# EAGLE design Franzino (EAGLE 8.3.1)
CNAME: Franzino; CREVISION: V0RV1; DESIGNER: Fábio Souza
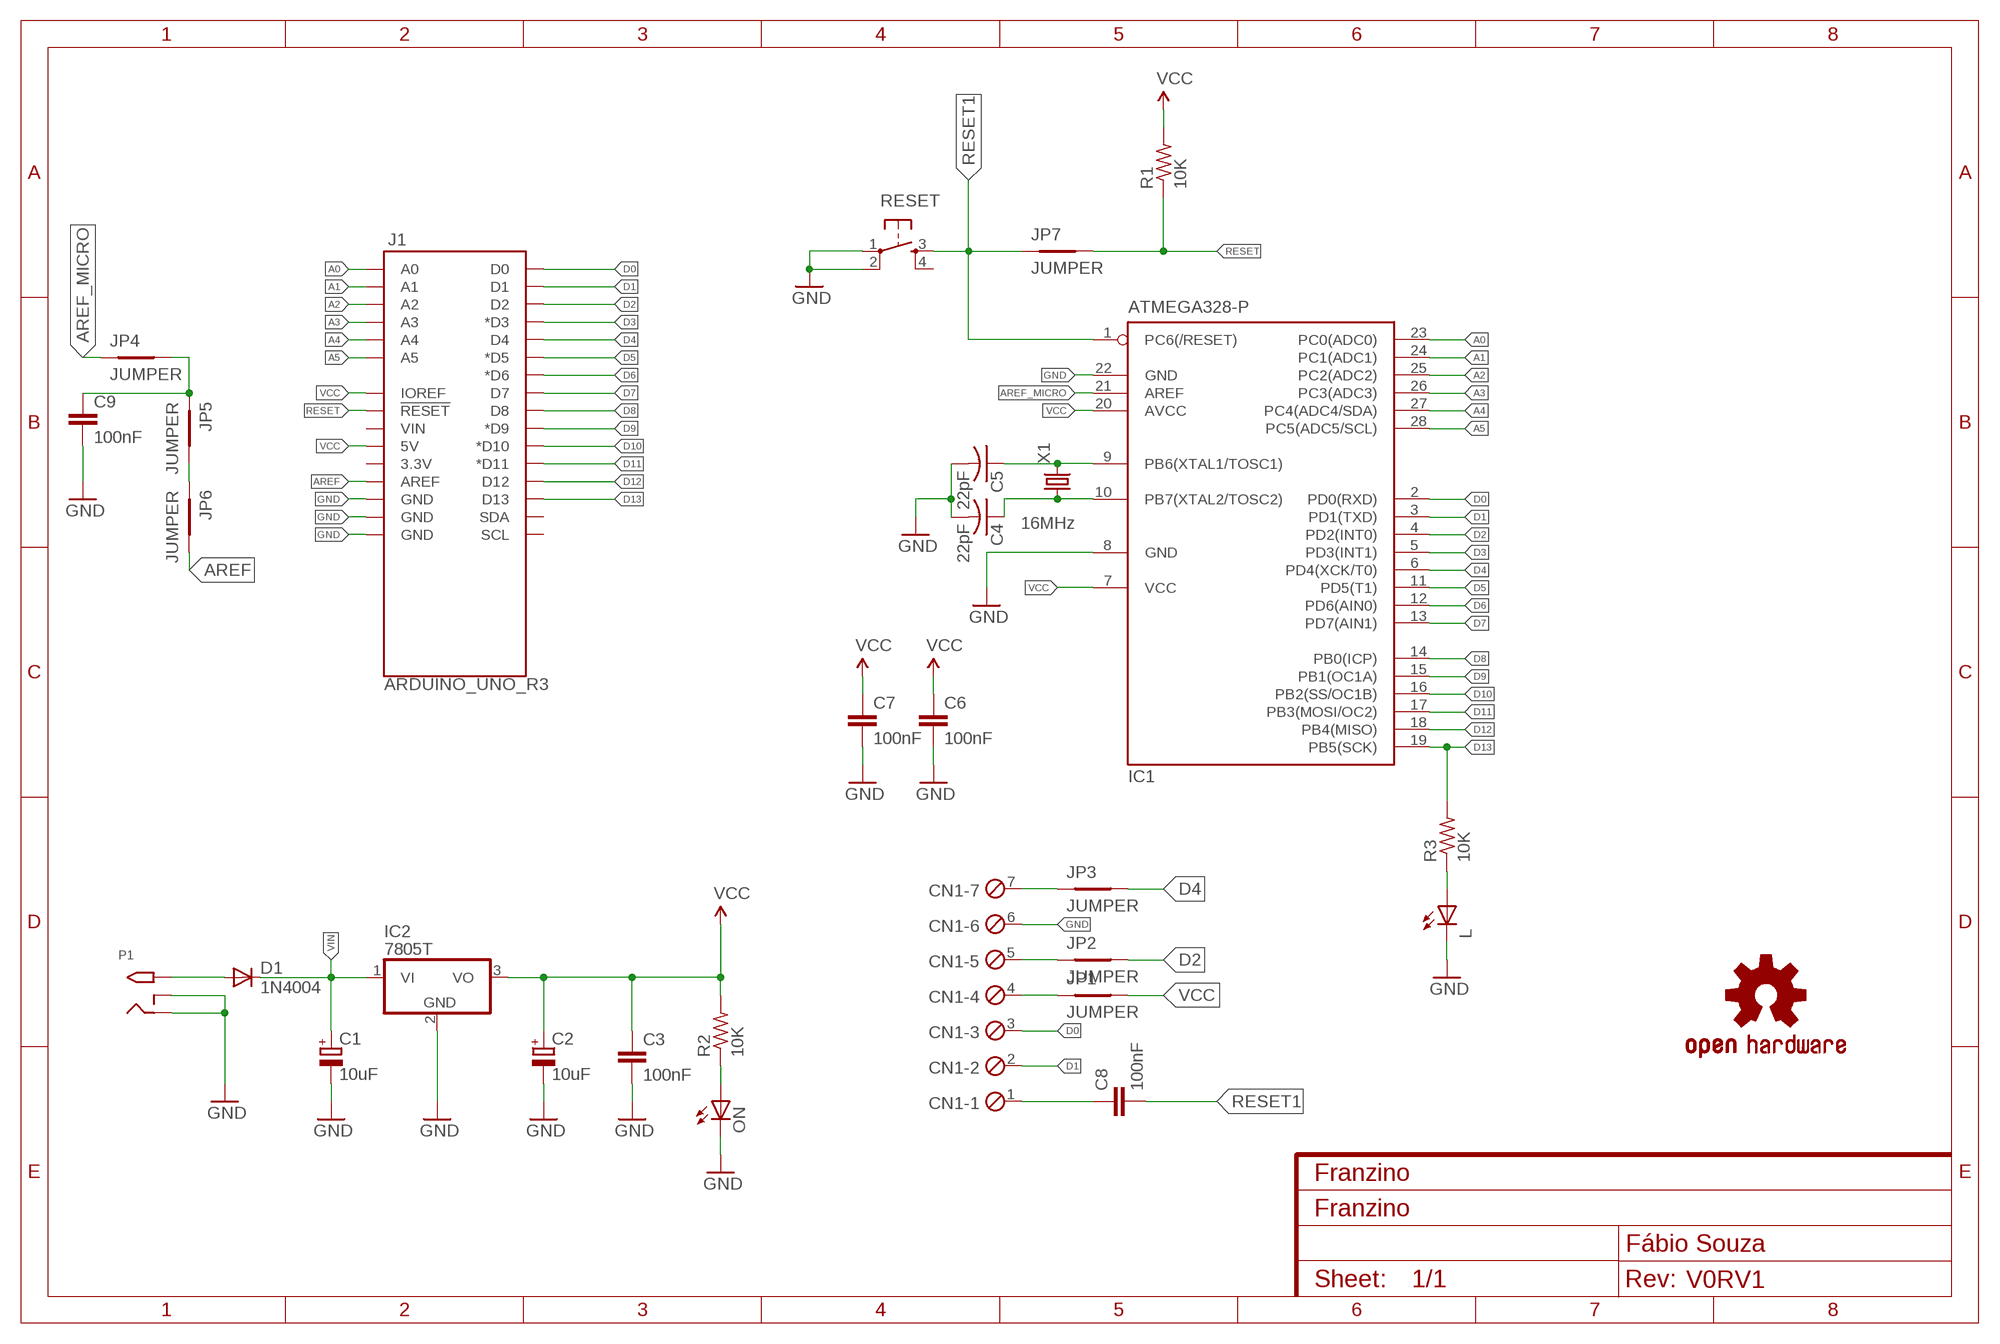
[diagram p0: schematic, sheet 1]

## Parts
C1  10uF  CPOL-EUE2.5-6  [E2,5-6]
C2  10uF  CPOL-EUE2.5-6  [E2,5-6]
C3  100nF  C-EU025-025X050  [C025-025X050]
C4  22pF  C-US025-024X044  [C025-024X044]
C5  22pF  C-US025-024X044  [C025-024X044]
C6  100nF  C-EU025-025X050  [C025-025X050]
C7  100nF  C-EU025-025X050  [C025-025X050]
C8  100nF  C-EU025-025X050  [C025-025X050]
C9  100nF  C-EU025-025X050  [C025-025X050]
CN1  BARRA de PINOS 6 VIAS  MPT7  [7POL254]
D1  1N4004  [DO41-10]
IC1  ATMEGA328-P  MEGA8-P  [DIL28-3]
IC2  7805T  [TO220H]
J1  ARDUINO_UNO_R3  [ARDUINO_UNO_R3_PINS]
JP1  JUMPER  [JUMP10]
JP2  JUMPER  [JUMP10]
JP3  JUMPER  [JUMP10]
JP4  JUMPER  [JUMP10]
JP5  JUMPER  [JUMP10]
JP6  JUMPER  [JUMP10]
JP7  JUMPER  [JUMP10]
L  LED 3mm Amarelo  LED3MM  [LED3MM]
LOGO2  OSHW-LOGOL  [OSHW-LOGO-L]
ON  LED 3 mm VERDE  LED3MM  [LED3MM]
P1  2.1MMJACKTHM  [PJ-102A]
R1  10K  R-US_0207/10  [0207/10]
R2  10K  R-US_0207/10  [0207/10]
R3  10K  R-US_0207/10  [0207/10]
RESET  CHAVE TACTIL 6 mm  TAC_SWITCHPTH  [TACTILE-PTH]
X1  16MHz  CRYSTALHC49S  [HC49/S]

## Nets
A0: IC1.23(PC0(ADC0)) J1.A0
A1: IC1.24(PC1(ADC1)) J1.A1
A2: IC1.25(PC2(ADC2)) J1.A2
A3: IC1.26(PC3(ADC3)) J1.A3
A4: IC1.27(PC4(ADC4/SDA)) J1.A4
A5: IC1.28(PC5(ADC5/SCL)) J1.A5
AREF: J1.AREF JP6.2
AREF_MICRO: IC1.21(AREF) JP4.1
D0: CN1.3 IC1.2(PD0(RXD)) J1.D0
D1: CN1.2 IC1.3(PD1(TXD)) J1.D1
D2: IC1.4(PD2(INT0)) J1.D2 JP2.2
D3: IC1.5(PD3(INT1)) J1.D3(*D3)
D4: IC1.6(PD4(XCK/T0)) J1.D4 JP3.2
D5: IC1.11(PD5(T1)) J1.D5(*D5)
D6: IC1.12(PD6(AIN0)) J1.D6(*D6)
D7: IC1.13(PD7(AIN1)) J1.D7
D8: IC1.14(PB0(ICP)) J1.D8
D9: IC1.15(PB1(OC1A)) J1.D9(*D9)
D10: IC1.16(PB2(SS/OC1B)) J1.D10(*D10)
D11: IC1.17(PB3(MOSI/OC2)) J1.D11(*D11)
D12: IC1.18(PB4(MISO)) J1.D12
D13: IC1.19(PB5(SCK)) J1.D13 R3.2
GND: C1.- C2.- C3.2 C4.2 C5.2 C6.2 C7.2 C9.2 CN1.6 IC1.8(GND) IC1.22(GND) IC2.2(GND) J1.GND@1(GND) J1.GND@2(GND) J1.GND@3(GND) L.K(C) ON.K(C) P1.RING P1.RING_SW RESET.1 RESET.2
N$1: D1.A P1.TIP
N$2: L.A R3.1
N$3: C8.1 CN1.1
N$4: CN1.4 JP1.1
N$5: CN1.5 JP2.1
N$6: ON.A R2.1
N$7: CN1.7 JP3.1
N$8: C5.1 IC1.9(PB6(XTAL1/TOSC1)) X1.2
N$9: C4.1 IC1.10(PB7(XTAL2/TOSC2)) X1.1
N$10: C9.1 JP4.2 JP5.1
N$11: JP5.2 JP6.1
RESET: J1.RESET@1(!RESET!) JP7.2 R1.1
RESET1: C8.2 IC1.1(PC6(/RESET)) JP7.1 RESET.3
VCC: C2.+ C3.1 C6.1 C7.1 IC1.7(VCC) IC1.20(AVCC) IC2.3(VO) J1.5V J1.IOREF JP1.2 R1.2 R2.2
VIN: C1.+ D1.C IC2.1(VI)
Unconnected: J1.3.3V J1.SCL J1.SDA J1.VIN RESET.4

## Library data of the parts
C1 C2 = rcl:CPOL-EU: POLARIZED CAPACITOR, European symbol
C3 C6 C7 = rcl:C-EU: CAPACITOR, European symbol
C4 C5 = adafruit:C-US: CAPACITOR, American symbol
C8 C9 = resistor:C-EU: CAPACITOR, European symbol
CN1 = con-phoenix-254:MPT7: PHOENIX CONNECTOR; OC_FARNELL: unknown; OC_NEWARK: unknown
D1 = adafruit:1N4004: DIODE General purpose 1N400x type rectifier (With bigger pads) http://www.ladyada.net/library/pcb/eaglelibrary.html
IC1 = atmel:MEGA8-P: MICROCONTROLLER 8 Kbytes FLASH, 1 kbytes SRAM, 512 bytes EEPROM, USART, 4-channel 10 bit ADC, 2-channel 8 bit ADC Pin compatible with Atmega48, ATMega88, ATMega168 Source: avr.lbr; OC_FARNELL: unknown; OC_NEWARK: unknown
IC2 = linear:78*: Positive VOLTAGE REGULATOR Source: http://cache.national.com/ds/LM/LM78L05.pdf http://www.fairchildsemi.com/ds/LM/LM7805.pdf
J1 = SparkFun-Boards:ARDUINO_UNO_R3: Arduino UNO R3 headers
JP1-JP7 = FBS_Library:JUMPER
L ON = adafruit:LED: LED OSRAM: - CHIPLED LG R971, LG N971, LY N971, LG Q971, LY Q971, LO R971, LY R971 LH N974, LH R974 LS Q976, LO Q976, LY Q976 LO Q996 - Hyper CHIPLED LW Q18S LB Q993, LB Q99A, LB R99A - SideLED LS A670, LO A670, LY A670, LG A670, LP A670 LB A673, LV A673, LT A673, LW A673 LH A674 LY A675 LS A676, LA A676, LO A676, LY A676, LW A676 LS A679, LY A679, LG A679 - Hyper Micro SIDELED® LS Y876, LA Y876, LO Y876, LY Y876 LT Y87S - SmartLED LW L88C, LW L88S LB L89C, LB L89S, LG L890 LS L89K, LO L89K, LY L89K LS L896, LA L896, LO L896, LY L896 - TOPLED LS T670, LO T670, LY T670, LG T670, LP T670 LSG T670, LSP T670, LSY T670, LOP T670, LYG T670 LG T671, LOG T671, LSG T671 LB T673, LV T673, LT T673, LW T673 LH T674 LS T676, LA T676, LO T676, LY T676, LB T676, LH T676, LSB T676, LW T676 LB T67C, LV T67C, LT T67C, LS T67K, LO T67K, LY T67K, LW E67C LS E67B, LA E67B, LO E67B, LY E67B, LB E67C, LV E67C, LT E67C LW T67C LS T679, LY T679, LG T679 LS T770, LO T770, LY T770, LG T770, LP T770 LB T773, LV T773, LT T773, LW T773 LH T774 LS E675, LA E675, LY E675, LS T675 LS T776, LA T776, LO T776, LY T776, LB T776 LHGB T686 LT T68C, LB T68C - Hyper Mini TOPLED® LB M676 - Mini TOPLED Santana® LG M470 LS M47K, LO M47K, LY M47K Source: http://www.osram.convergy.de/
LOGO2 = SparkFun-Aesthetics:OSHW-LOGO: Open Source Hardware Logo This logo indicates the piece of hardware it is found on incorporates a OSHW license and/or adheres to the definition of open source hardware found here: http://freedomdefined.org/OSHW
P1 = adafruit:2.1MMJACK: 2.1mm x 5.5mm THM DC jack with internal switch. Digikey part #PJ-102A, 4UCON part #05537 2.1mm x 5.5mm SMT DC jack with internal switch. Digikey part #PJ-002A-SMT, 4UCON part #03267 By microbuilder.eu & adafruit.com
R1-R3 = adafruit:R-US_: RESISTOR, American symbol
RESET = SparkFun-Retired:TAC_SWITCH: Momentary Switch Button commonly used for reset or general input. Spark Fun Electronics SKU : COM-00097 SMT- SWCH-08247
X1 = adafruit:CRYSTAL: CRYSTAL; OC_FARNELL: 1667008; OC_NEWARK: unknown

## Board
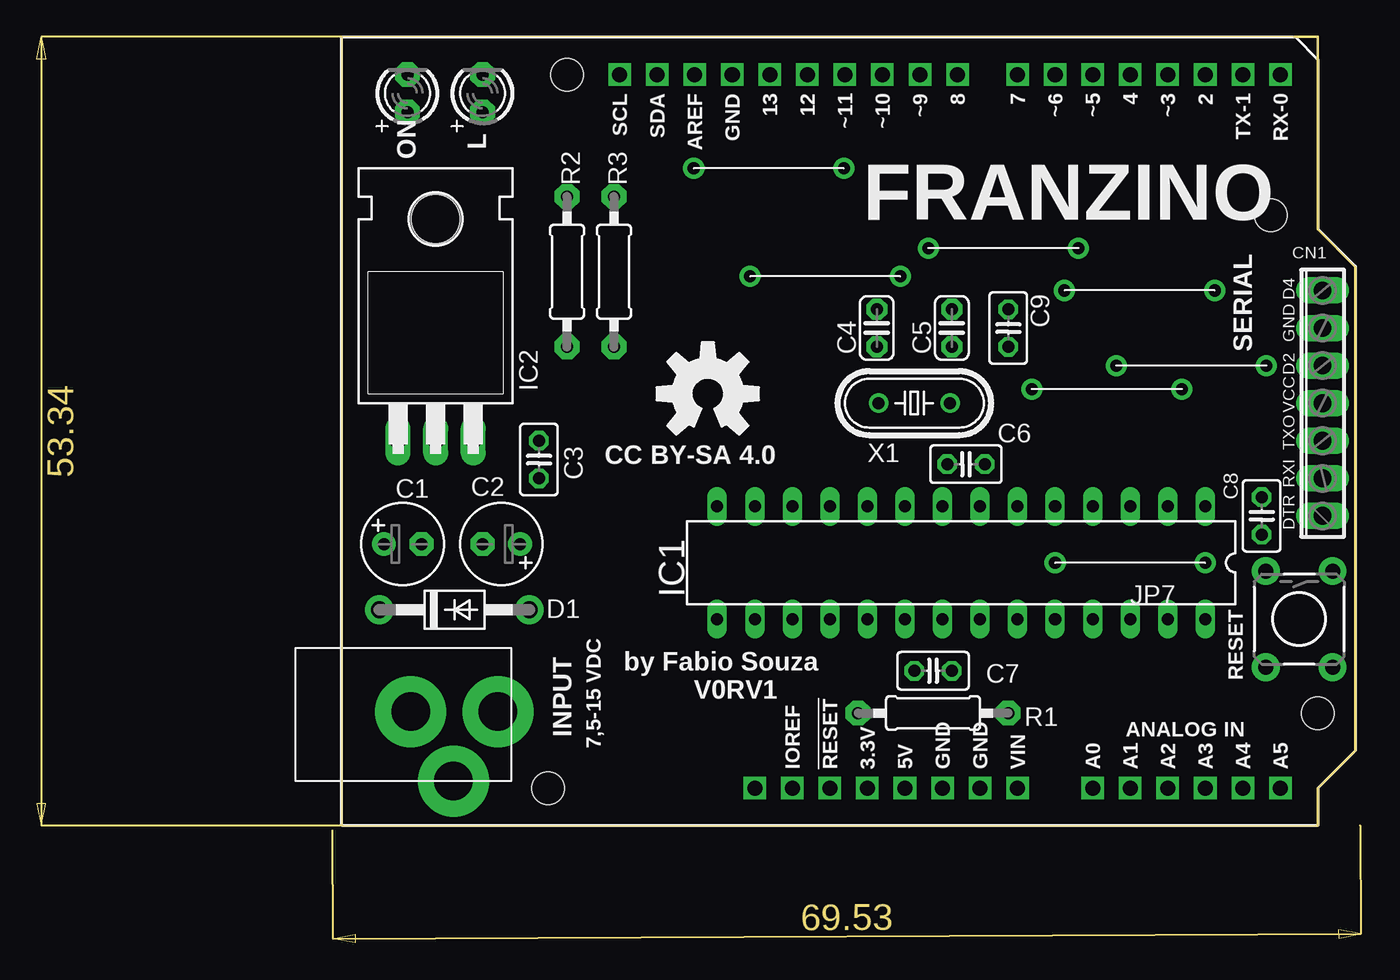
[diagram p1: board, top side]
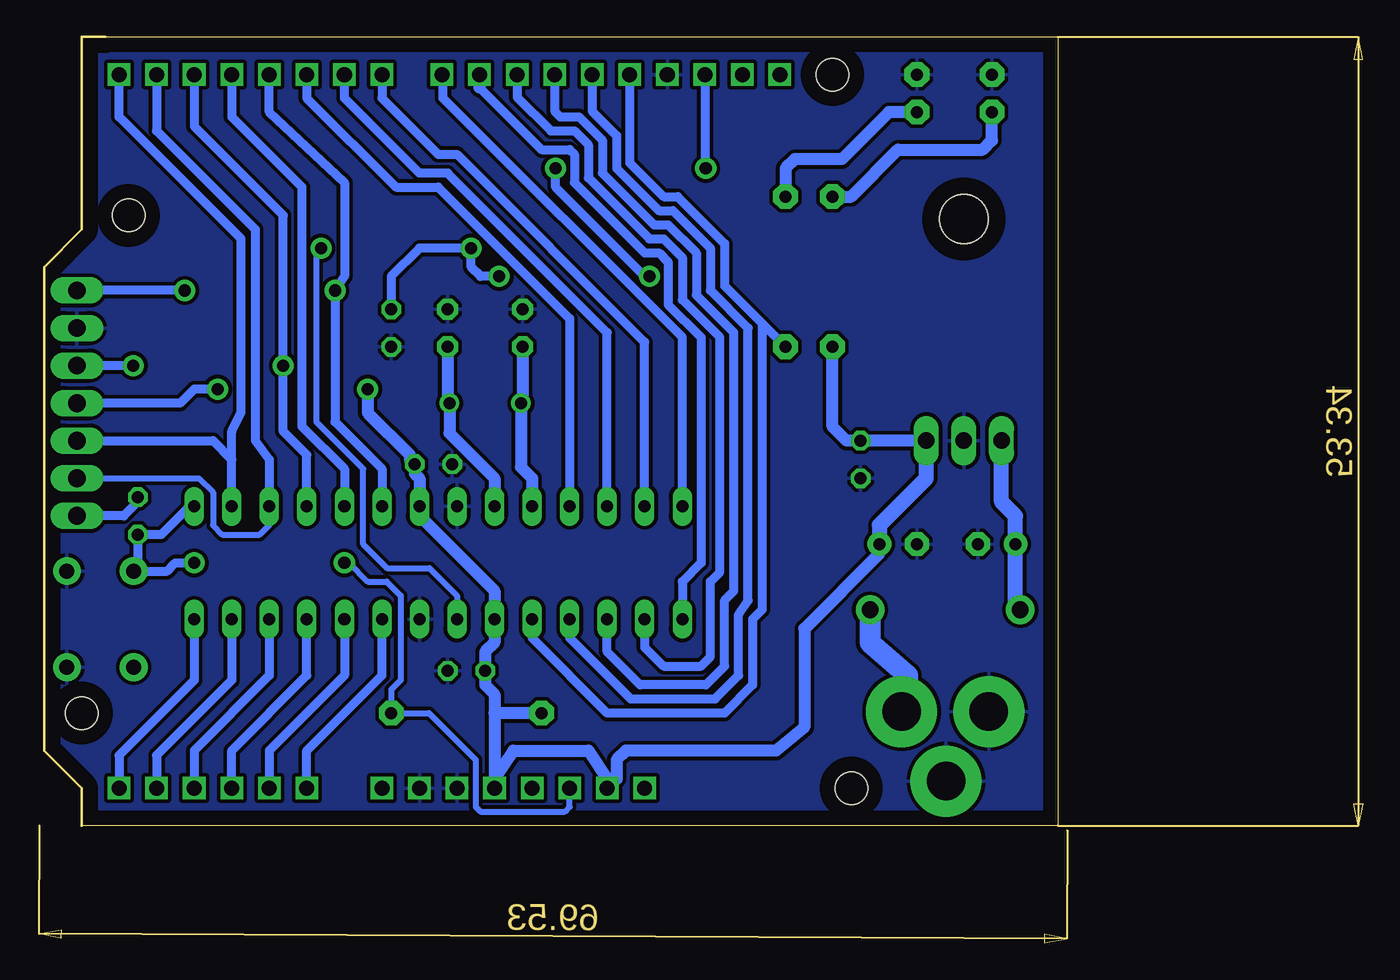
[diagram p2: board, bottom side, seen from below]

Size 68.58 x 53.34 mm. Coordinates in mm from the lower left corner, seen from the top.
Outline: 0,0 66.04,0 66.04,2.54 68.58,5.08 68.58,37.78 66.04,40.32 66.04,53.34 64.45,53.34 0,53.34 0,0
Copper layers (1*16): Top 0.035mm / dielectric 1.5mm / Bottom 0.035mm
Design rules "default": minimum track width 10mil, minimum drill 24mil, track to track 8mil, track to pad 8mil, pad to pad 8mil, via to via 8mil, smd to smd 8mil, copper to edge 40mil, drill to drill 8mil, minimum pad ring 10mil, minimum via ring 8mil, stop-mask expansion 4mil, vias tented up to drill 0mil, thermal gap 10mil
Holes 2.2 mm at 13.97,2.54 66.04,7.62 15.24,50.8 62.87,41.27

### Footprints (pad centres in the part's own frame; a part is rotated, then mirrored left to right if it is on the bottom)
E2,5-6 = drill 0.813 pad 1.6: + -1.27,0 | drill 0.813 pad 1.6 octagon: - 1.27,0
C025-025X050 = drill 0.813 octagon: 1 -1.27,0; 2 1.27,0
C025-024X044 = drill 0.813 pad 1.422 octagon: 1 -1.27,0; 2 1.27,0
7POL254 = drill 1.2 long: 1 -7.62,0; 2 -5.08,0; 3 -2.54,0; 4 0,0; 5 2.54,0; 6 5.08,0; 7 7.62,0
DO41-10 = drill 1.118 pad 1.93: A 5.08,0; C -5.08,0
DIL28-3 = drill 0.813 long: 1 -16.51,-3.81; 2 -13.97,-3.81; 3 -11.43,-3.81; 4 -8.89,-3.81; 5 -6.35,-3.81; 6 -3.81,-3.81; 7 -1.27,-3.81; 8 1.27,-3.81; 9 3.81,-3.81; 10 6.35,-3.81; 11 8.89,-3.81; 12 11.43,-3.81; 13 13.97,-3.81; 14 16.51,-3.81; 15 16.51,3.81; 16 13.97,3.81; 17 11.43,3.81; 18 8.89,3.81; 19 6.35,3.81; 20 3.81,3.81; 21 1.27,3.81; 22 -1.27,3.81; 23 -3.81,3.81; 24 -6.35,3.81; 25 -8.89,3.81; 26 -11.43,3.81; 27 -13.97,3.81; 28 -16.51,3.81
TO220H = drill 1.118 long: 1 -2.54,-10.16; 2 0,-10.16; 3 2.54,-10.16 | hole 3.302: 0,4.826
ARDUINO_UNO_R3_PINS = drill 1.016 pad 1.422 square: 3.3V 35.56,2.54; 5V 38.1,2.54; A0 50.8,2.54; A1 53.34,2.54; A2 55.88,2.54; A3 58.42,2.54; A4 60.96,2.54; A5 63.5,2.54; AREF 23.876,50.8; D0 63.5,50.8; D1 60.96,50.8; D2 58.42,50.8; D3 55.88,50.8; D4 53.34,50.8; D5 50.8,50.8; D6 48.26,50.8; D7 45.72,50.8; D8 41.656,50.8; D9 39.116,50.8; D10 36.576,50.8; D11 34.036,50.8; D12 31.496,50.8; D13 28.956,50.8; GND@1 40.64,2.54; GND@2 43.18,2.54; GND@3 26.416,50.8; IOREF 30.48,2.54; NC 27.94,2.54; RESET@1 33.02,2.54; SCL 18.796,50.8; SDA 21.336,50.8; VIN 45.72,2.54
JUMP10 = drill 0.813 pad 1.422: 1 0,0; 2 10.16,0
LED3MM = drill 0.813 pad 1.676 octagon: A -1.27,0; K 1.27,0
PJ-102A = drill 2.6 pad 4.8: RING 0.1,-3.39; RING_SW -4.6,-6.29; TIP 0.1,-9.29
0207/10 = drill 0.813 pad 1.676 octagon: 1 -5.08,0; 2 5.08,0
TACTILE-PTH = drill 1.016 pad 1.88: 1 -3.251,2.261; 2 3.251,2.261; 3 -3.251,-2.261; 4 3.251,-2.261
HC49/S = drill 0.813: 1 -2.413,0; 2 2.413,0

### Placement (x,y rotation side)
C1  4.13,19.05 0 top
C2  10.79,19.05 180 top
C3  13.34,24.77 270 top
C4  36.2,33.66 90 top
C5  41.27,33.66 90 top
C6  42.23,24.45 180 top
C7  40.01,10.48 0 top
C8  62.23,20.95 270 top
C9  45.09,33.66 270 top
CN1  66.36,28.57 90 top
D1  7.62,14.61 0 top
IC1  41.91,17.78 180 top
IC2  6.35,36.2 0 top
J1  0,0 0 top
JP1  56.83,29.53 180 top
JP2  62.55,31.11 180 top
JP3  59.05,36.2 180 top
JP4  49.85,39.05 180 top
JP5  37.78,37.15 180 top
JP6  33.97,44.45 180 top
JP7  58.42,17.78 180 top
L  9.53,49.53 90 top
LOGO2  24.77,29.21 0 top
ON  4.45,49.53 90 top
P1  1.27,7.62 90 top
R1  40.01,7.62 180 top
R2  15.24,37.47 270 top
R3  18.41,37.47 270 top
RESET  64.77,13.97 270 top
X1  38.73,28.57 0 top

### Tracks (layer width: path | path; a pad name or v marks a point on that pad's centre or on a via)
A0
  Bottom 0.61: J1.A0 50.8,5.08 45.72,10.16 IC1.23
A1
  Bottom 0.61: IC1.24 48.26,10.16 53.34,5.08 J1.A1
A2
  Bottom 0.61: J1.A2 55.88,5.08 50.8,10.16 IC1.25
A3
  Bottom 0.61: IC1.26 53.34,10.16 58.42,5.08 J1.A3
A4
  Bottom 0.61: IC1.27 55.88,9.84 60.96,4.76 J1.A4
A5
  Bottom 0.61: IC1.28 58.42,9.84 63.5,4.76 J1.A5
AREF
  Bottom 0.61: J1.AREF 23.88,44.51 JP6.2
AREF_MICRO
  Bottom 0.406: IC1.21 40.64,15.56 42.5,17.41 45.35,17.41 46.99,19.05 46.99,24.13 50.16,27.3 50.16,38.42 JP4.1
D0
  Bottom 0.61: IC1.2 55.88,24.77 | 55.88,24.77 55.88,26.67 55.24,27.94 55.24,39.69 63.5,47.94 J1.D0 | CN1.3 57.15,26.04 55.88,24.77
D1
  Bottom 0.406: IC1.3 53.34,20.32 53.98,19.68 56.52,19.68 57.15,20.32 57.15,22.54 58.1,23.5 CN1.2
  Bottom 0.61: J1.D1 60.96,46.99 54.29,40.32 54.29,26.04 53.34,24.77 IC1.3
D2
  Bottom 0.61: IC1.4 50.8,25.08 52.39,26.67 JP2.2 52.39,41.27 58.42,47.31 J1.D2
D3
  Bottom 0.61: J1.D3 55.88,47.94 51.12,43.18 51.12,26.99 48.26,24.13 IC1.5
D4
  Bottom 0.61: J1.D4 53.34,48.26 48.26,43.5 48.26,37.15 JP3.2 48.9,27.3 45.72,24.13 IC1.6
D5
  Bottom 0.61: J1.D5 50.8,49.21 44.77,43.18 41.91,43.18 33.02,34.29 IC1.11
D6
  Bottom 0.61: IC1.12 30.48,33.34 41.27,44.13 43.18,44.13 48.26,49.21 J1.D6
D7
  Bottom 0.61: IC1.13 27.94,32.7 40.64,45.4 41.91,45.4 45.72,49.21 J1.D7
D8
  Bottom 0.61: IC1.14 25.4,33.02 41.59,49.21 41.59,50.74 J1.D8
D9
  Bottom 0.61: IC1.15 25.4,16.51 24.13,17.78 24.13,33.02 26.35,35.24 26.35,38.1 26.99,38.73 27.94,38.73 32.7,43.5 32.7,45.4 33.02,45.72 34.92,45.72 39.12,49.91
  Bottom 0.813: J1.D9 39.12,49.91
D10
  Bottom 0.61: IC1.16 27.94,12.06 26.67,10.79 24.13,10.79 23.5,11.43 23.5,16.51 22.86,17.14 22.86,33.02 25.4,35.56 25.4,38.42 26.67,39.69 27.62,39.69 31.75,43.81 31.75,46.04 32.7,46.99 34.29,46.99 36.58,49.28 J1.D10
D11
  Bottom 0.61: J1.D11 34.04,48.32 33.66,47.94 32.38,47.94 30.8,46.35 30.8,44.13 27.3,40.64 26.35,40.64 24.45,38.73 24.45,35.88 21.91,33.34 21.91,15.88 22.54,15.24 22.54,10.79 23.81,9.53 28.26,9.53 30.48,11.75 IC1.17
D12
  Bottom 0.61: IC1.18 33.02,12.7 28.89,8.57 23.18,8.57 21.59,10.16 21.59,14.29 20.95,15.24 20.95,33.66 23.5,36.2 23.5,39.05 26.04,41.59 26.99,41.59 29.84,44.45 29.84,46.67 31.5,48.32 J1.D12
D13
  Bottom 0.61: J1.D13 28.96,44.83 26.67,42.55 25.72,42.55 22.54,39.37 22.54,36.51 20,33.97 | 20,33.97 20,14.61 20.64,13.97 20.64,9.53 22.54,7.62 30.48,7.62 35.56,12.7 IC1.19 | R3.2 20,33.97
GND
  pour Bottom (isolate 0.254, rank 3): -0.95,53.98 64.45,53.98 66.36,52.07 66.36,40.64 68.9,38.1 68.9,5.08 66.36,2.54 66.36,0 -0.64,-0.32
N$1
  Bottom 1.422: D1.A 12.7,12.38 10.16,10.16 10.16,8.12 P1.TIP
N$2
  Bottom 0.813: L.A 11.43,48.26 14.61,45.09 17.78,45.09 18.41,44.45 R3.1
N$3
  Bottom 0.61: C8.1 62.23,21.91 63.18,20.95 CN1.1
N$4
  Bottom 0.61: JP1.1 58.42,29.53 59.37,28.57 CN1.4
N$5
  Bottom 0.61: JP2.1 CN1.5
N$6
  Bottom 0.813: R2.1 13.97,42.55 10.79,45.72 5.08,45.72 4.45,46.35 ON.A
N$7
  Bottom 0.61: JP3.1 CN1.7
N$8
  Bottom 0.813: IC1.9 38.1,23.5 41.15,26.54 X1.2 41.27,28.7 C5.1
N$9
  Bottom 0.813: IC1.10 35.56,23.5 36.32,24.26 X1.1 36.2,28.7 C4.1
N$10
  Bottom 0.61: JP5.1 39.05,37.15 39.69,37.78 JP4.2 43.18,39.05 45.09,37.15 C9.1
N$11
  Bottom 0.61: JP5.2 27.94,37.15 33.97,43.18 JP6.1
RESET
  Bottom 0.406: JP7.2 47.94,17.78 46.67,16.51 45.4,16.51 44.45,15.56 44.45,9.84 45.09,9.21 R1.1 42.55,7.62 39.37,4.45 39.37,1.27 39.05,0.95 33.34,0.95 33.02,1.27 J1.RESET@1
RESET1
  Bottom 0.61: IC1.1 58.74,21.59 60.64,19.68 C8.2 62.23,17.5 RESET.3 60.25,17.22 59.69,17.78 JP7.1
VCC
  Bottom 0.813: 38.1,7.62 J1.5V 38.1,3.17 36.83,5.08 31.75,5.08 30.48,3.17 J1.IOREF 29.84,3.17 29.84,4.45 29.21,5.08 19.05,5.08 17.14,6.67 17.14,13.34 12.06,18.41 12.06,20.32 | R1.2 38.1,7.62 | 38.1,7.62 38.1,8.89 38.73,9.53 C7.1 38.73,11.75 38.1,12.38 IC1.20 38.1,15.88 43.18,20.95 IC1.7 43.18,23.5 43.5,23.81 C6.1 43.81,24.77 43.81,25.08 46.67,27.94 JP1.2 | IC2.3 C3.1 14.29,26.04 15.24,26.99 R2.2
  Bottom 1.016: IC2.3 8.89,23.5 12.06,20.32 C2.+
VIN
  Bottom 1.016: D1.C 2.86,14.61 C1.+ 2.86,20.95 3.81,21.91 IC2.1

### Text on the board
tNames: FRANZINO | D4 | GND | SERIAL | D2 | VCC | TXO | CC BY-SA 4.0 | RXI | DTR | 7,5-15 VDC | INPUT | by Fabio Souza | V0RV1 | ANALOG IN
tSilk: ~ | ~ | ~ | ~ | ~ | ~